# Altium schematic sheet [10]-POWER.SchDoc
size A4; Organization: Altium Limited; Address1: L3, 12a Rodborough Rd; Address2: Frenchs Forest; Address3: NSW; Address4: Australia 2086
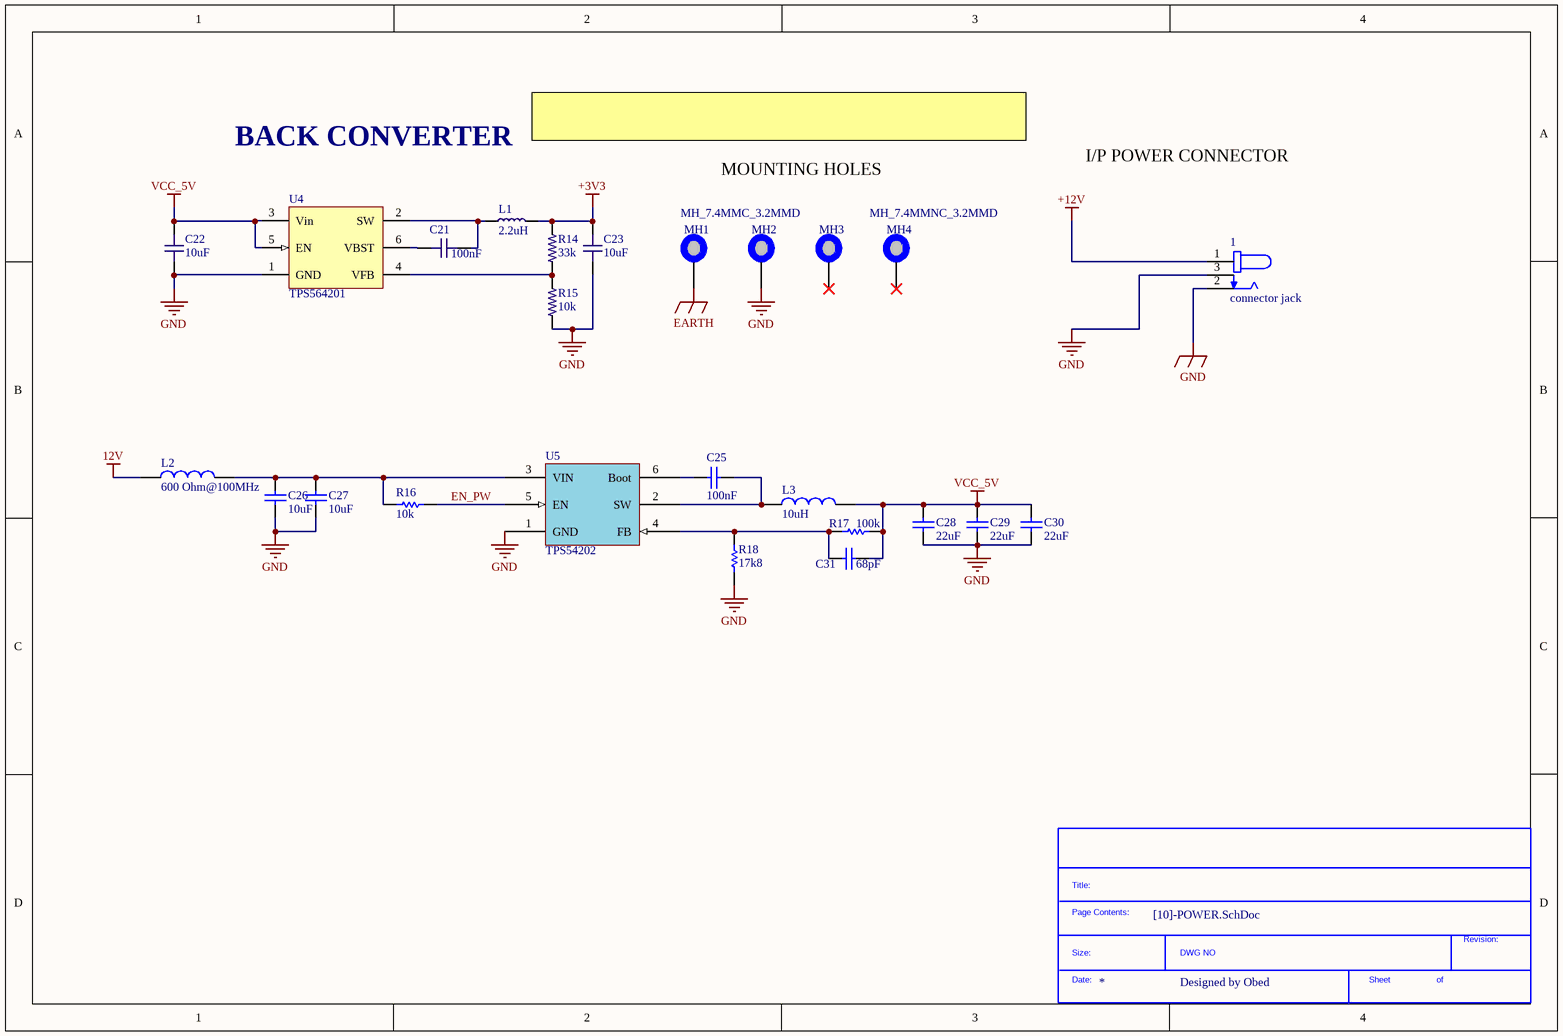
[diagram p0: [10]-POWER.SchDoc]

## Parts
1  connector jack  [GCT_DCJ200-10-A-XX-K_REVA]
*?  SDTitleBlock  (value not drawn)  (graphical)
C21  value 100nF  [C0402-HIGH-DENSITY]  (hidden comment: C0402 100nF 10V X5R)
C22  value 10uF  [C0402-HIGH-DENSITY]  (hidden comment: C0402 10uF 10V)
C23  value 10uF  [C0402-HIGH-DENSITY]  (hidden comment: C0402 10uF 10V)
C25  value 100nF  [CAP0603]  (hidden comment: 100nfF 10V 0805 X5R)
C26  value 10uF  [CAP1206]  (hidden comment: 10uF 50V 1206 X5R)
C27  value 10uF  [CAP1206]  (hidden comment: 10uF 50V 1206 X5R)
C28  value 22uF  [CAP0805]  (hidden comment: 22uF 10V 0805 X5R)
C29  value 22uF  [CAP0805]  (hidden comment: 22uF 10V 0805 X5R)
C30  value 22uF  [CAP0805]  (hidden comment: 22uF 10V 0805 X5R)
C31  value 68pF  [CAP0603]  (hidden comment: 68pF 50V 0603 NP0)
L1  value 2.2uH  [L1008]  (hidden comment: SDEM25201B-2R2MS)
L2  value 600 Ohm@100MHz  [0805L]  (hidden comment: 74279220601)
L3  value 10uH  [SRN6045]  (hidden comment: SRN6045-100M)
MH1  MH_7.4MMC_3.2MMD  [MH_7.4MMC_3.2MMD]
MH2  MH_7.4MMC_3.2MMD  [MH_7.4MMC_3.2MMD]  (value not drawn)
MH3  MH_7.4MMC_3.2MMD  [MH_7.4MMC_3.2MMD]  (value not drawn)
MH4  MH_7.4MMNC_3.2MMD  [MH_7.4MM_3.2MMD_NON_COPPER_NPTH]
R14  value 33k  [R0402-HIGH-DENSITY]  (hidden comment: R0402 33k 1%)
R15  value 10k  [R0402-HIGH-DENSITY]  (hidden comment: R0402 10k 1%)
R16  value 10k  [RES0603]  (hidden comment: 10k_0603)
R17  value 100k  [RES0603]  (hidden comment: 100k_0603)
R18  value 17k8  [RES0603]  (hidden comment: 17k8_0603)
U4  TPS564201  [SOT95P280X90-6N]
U5  TPS54202  [dc12v]

## Nets
12V: L2.1
+3V3: C23.2 L1.2 R14.2
+12V: 1.1
EARTH: MH1.1
GND: 1.2 1.3 C22.1 C23.1 C26.1 C27.1 C28.1 C29.1 C30.1 MH2.1 R15.1 R18.1 U4.1(GND) U5.1(GND)
VCC_5V: C22.2 C28.2 C29.2 C30.2 C31.2 L3.2 R17.2 U4.3(Vin) U4.5(EN)
EN_PW: R16.1 U5.5(EN)
NetC21_1: C21.1 L1.1 U4.2(SW)
NetC21_2: C21.2 U4.6(VBST)
NetC25_1: C25.1 U5.6(Boot)
NetC25_2: C25.2 L3.1 U5.2(SW)
NetC26_2: C26.2 C27.2 L2.2 R16.2 U5.3(VIN)
NetC31_1: C31.1 R17.1 R18.2 U5.4(FB)
NetR14_1: R14.1 R15.2 U4.4(VFB)

Not connected (* = marked no-connect by the designer): MH3 1*; MH4 1*

## Notes on the sheet
- BACK CONVERTER
- POWER
- MOUNTING HOLES
- I/P POWER CONNECTOR
- Designed by Obed
- Title
- Size:
- Date:
- A4
- Number:
- Time:
- Revision:
- Sheet
- of
- File:
- (in symbol SDTitleBlock) Title:; Page Contents:; Revision:; Size:; DWG NO; Date:; Sheet; of

## Library data of the parts
1 = connector jack: Power Barrel Connector Jack 2.05mm ID (0.081), 5.50mm OD (0.217) Through Hole, Right Angle; MF: Global Connector Technology; MP: DCJ200-10-A-K1-K; SnapEDA_Link: https://www.snapeda.com/parts/DCJ200-10-A-K1-K/Global+Connector+Technology/view-part/?ref=snap; Package: None; Value: *; Check_prices: https://www.snapeda.com/parts/DCJ200-10-A-K1-K/Global+Connector+Technology/view-part/?ref=eda
C21 = C0402 100nF 10V X5R: Chip Capacitor, 0402, 100nF, 10V, X5R; EIA Code: X5R; Max. Voltage: 10V; Supplier 1: Digi-Key; Supplier Part Number 1: 311-1336-1-ND
C22 C23 = C0402 10uF 10V: Chip Capacitor, 0402, 10uF, 10V, X5R; EIA Code: X5R; Max. Voltage: 10V; Supplier 1: Digi-Key; Supplier Part Number 1: 1276-1450-2-ND
C25 = 100nF 50V 0805 X5R_1: 100nF 50V 0805 X5R; Tolerance: 10%; Voltage: 50V; Supplier1: Digikey; Supplier2: Mouser; Supplier3: Farnell; RefSupplier2: *; RefSupplier3: *; Case: 0805; Material: X5R
C26 C27 = 10uF 50V 1206 X5R: Tolerance: 10%; Voltage: 50V; Supplier1: Digikey; Supplier2: Mouser; Supplier3: Farnell; RefSupplier1: 1276-6736-1-ND; RefSupplier2: *; RefSupplier3: *; Case: 1206; Material: X5R
C28-C30 = 22uF 10V 0805 X5R: Tolerance: 10%; Voltage: 10V; Supplier1: Digikey; Supplier2: Mouser; Supplier3: Farnell; RefSupplier1: 490-10511-1-ND; RefSupplier2: *; RefSupplier3: *; Case: 0805; Material: X5R
C31 = 68pF 50V 0603 NP0: Tolerance: 10%; Voltage: 50V; Supplier1: Digikey; Supplier2: Mouser; Supplier3: Farnell; RefSupplier1: 490-11301-1-ND; RefSupplier2: *; RefSupplier3: *; Case: 0603; Material: NP0
L1 = SDEM25201B-2R2MS: 2.2µH Shielded Inductor 2.05A 117mOhm Max 1008 (2520 Metric); Supplier 1: Digi-Key; Supplier Part Number 1: 2037-SDEM25201B-2R2MSCT-ND
L2 = 74279220601: 0805, 600 Ohm@100MHz, 2.1A; Manufacturer: Wurth; PartNumber: 74279220601; Size: 0805; Supplier1: Digikey; RefSupplier1: 732-6126-1-ND
L3 = SRN6045-100M: SRN6045-100M 10uH 2.5A 6x6x4,5mm; Manufacturer: Bourns; PartNumber: SRN6045-100M; Rated Current: 2.5A; Case: 6045; Supplier1: Digikey; Supplier2: Mouser; Supplier3: Farnell; RefSupplier2: *; RefSupplier3: *
MH1-MH3 = MH_7.4MMC_3.2MMD: Mounting Hole 7.4mm Diameter, 3.2mm Dril
MH4 = MH_7.4MMNC_3.2MMD: Mounting Hole 7.4mm Diameter (Non Copper), 3.2mm Dril NPTH
R14 = R0402 33k 1%: Chip Resistor, 0402, 33k ohms, 1%, 1/16 W; Supplier 1: Digi-Key; Supplier Part Number 1: 311-33.0KLRCT-ND
R15 = R0402 10k 1%: Chip Resistor, 0402, 10k ohms, 1%, 1/16 W; Supplier 1: Digi-Key; Supplier Part Number 1: 311-10.0KLRCT-ND
R16 = 10k: Resistor 10k 0603 1%; Case: 0603; Tolerance: 1%; Size: 0603, 1.6x0.8x0.8mm; RefSupplier1: 311-10.0KHRCT-ND; RefSupplier2: *; RefSupplier3: *; Supplier1: Digikey; Supplier2: *; Supplier3: *
R17 = 100k: Resistor 100k 0603 1%; Case: 0603; Tolerance: 1%; Supplier1: Digikey; Supplier2: *; Supplier3: *; RefSupplier1: 311-100KHRCT-ND; RefSupplier2: *; RefSupplier3: *
R18 = 17k8: Resistor 17k8 0603 1%; Case: 0603; Tolerance: 1%; Supplier1: Digikey; Supplier2: *; Supplier3: *; RefSupplier1: 311-17.8KHRTR-ND; RefSupplier2: *; RefSupplier3: *
U4 = TPS564201: Buck Converter, 4.5-17V in, 0.76-7V out, 4A, TSOT-6; Manufacturer: Texas Instruments; Supplier: Digi-Key; Supplier Part Number: 296-44195-1-ND; Manufacturer Part Number: TPS564201; Last Modified By: Peter Kazakoff; Last Modified Date: November 13th 2016; Supplier 1: Digi-Key; Supplier Part Number 1: 296-44195-1-ND
U5 = TPS54202: 4.5V to 28V Input, 2A Output Sync Buck; PartNumber: TPS54202DDC; Manufacturer: TI; Case: SOT23-6